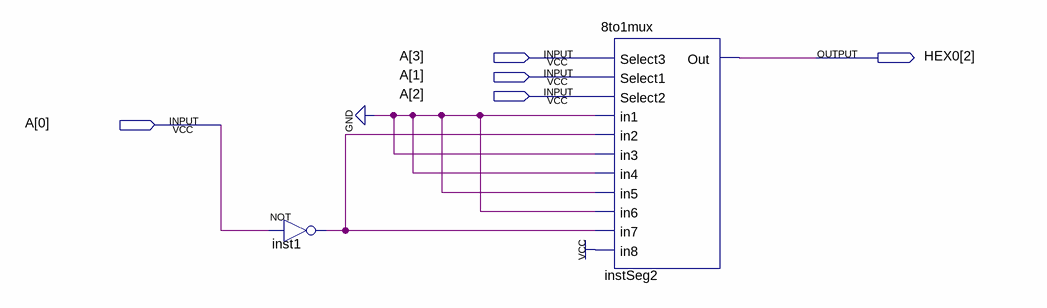
[diagram p0: schematic sheet]
// Quartus schematic seg2.bdf as structural Verilog: 2 symbols, 5 pins
module seg2 (
  input  [3:0] A,
  output [2:2] HEX0
);

  wire inst1_out;

  not inst1 (inst1_out, A[0]);
  \8to1mux  instSeg2 (
    .Select3(A[3]), .Select1(A[1]), .Select2(A[2]), .in1(1'b0), .in2(inst1_out), .in3(1'b0), .in4(1'b0),
    .in5(1'b0), .in6(1'b0), .in7(inst1_out), .in8(1'b1), .Out(HEX0[2]));
endmodule
